# Altium schematic sheet HardwareSchematicv2.SchDoc
size A4; SheetNumber: 3; SheetTotal: 3
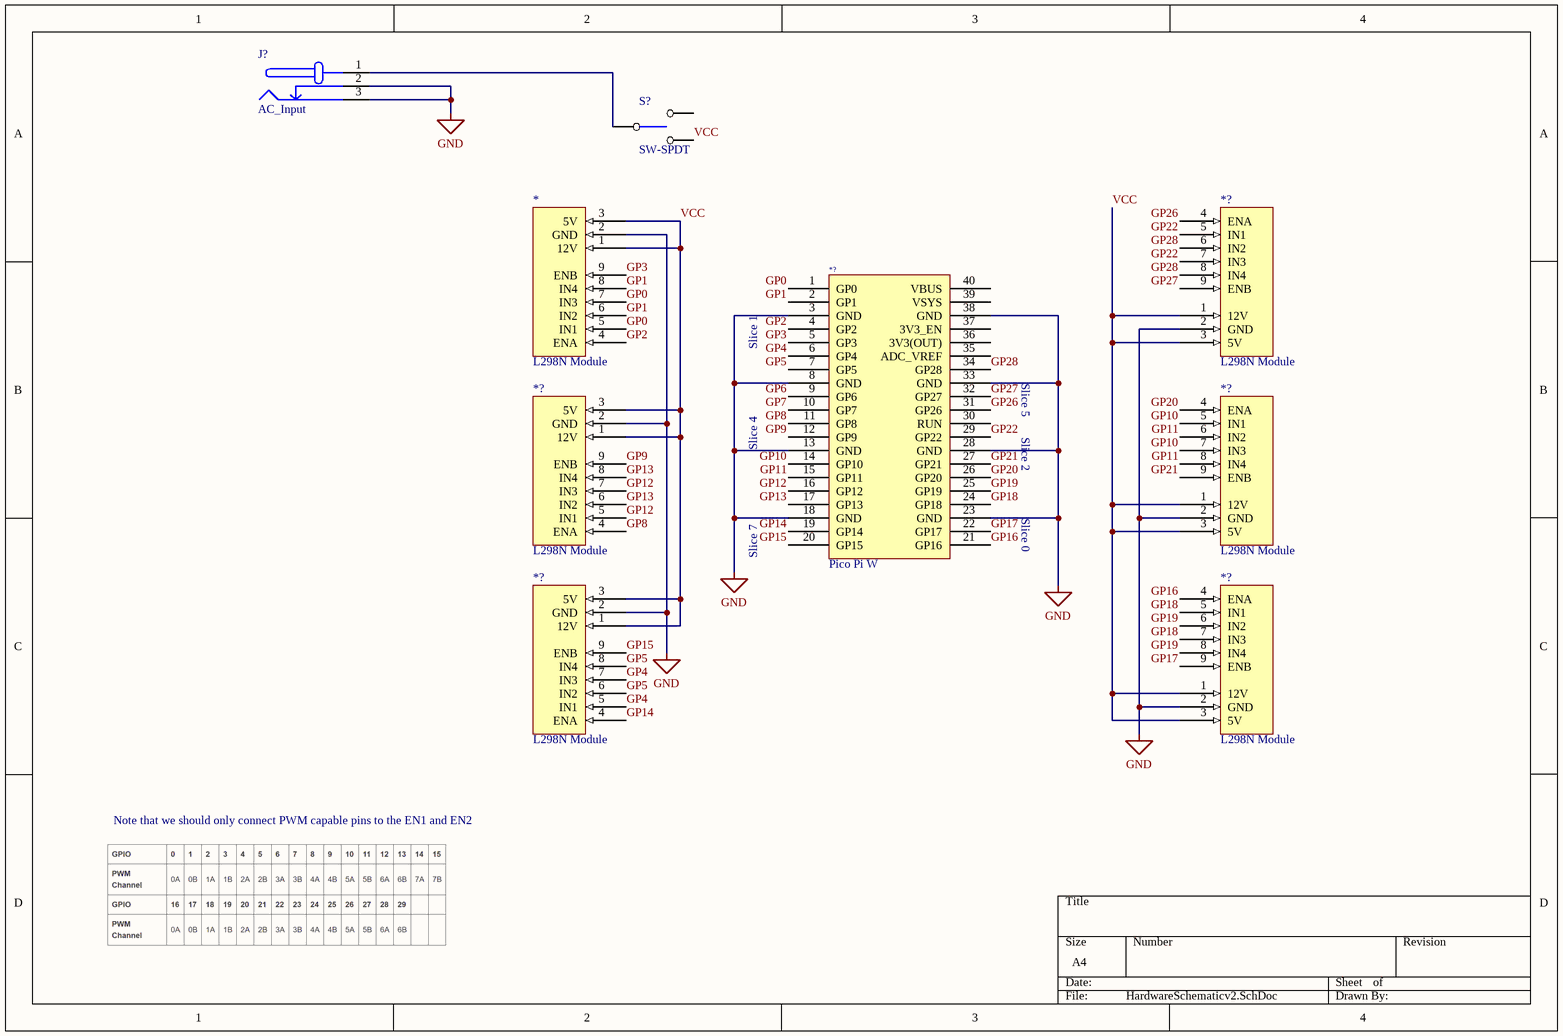
[diagram p0: HardwareSchematicv2.SchDoc]

## Parts
(Parts that share a designator on the sheet are numbered #1, #2 ... from top to bottom, then left to right.)
*  L298N Module  [New footprint 1]
*?#1  L298N Module  [New footprint 1]
*?#2  Pico Pi W  [New footprint 1]
*?#3  L298N Module  [New footprint 1]
*?#4  L298N Module  [New footprint 1]
*?#5  L298N Module  [New footprint 1]
*?#6  L298N Module  [New footprint 1]
J?  AC_Input  [AC-Socket]
S?  SW-SPDT  [SW-SPDT]

## Nets
GND: *.2(GND) *?#1.2(GND) *?#2.3(GND) *?#2.8(GND) *?#2.13(GND) *?#2.18(GND) *?#2.23(GND) *?#2.28(GND) *?#2.33(GND) *?#2.38(GND) *?#3.2(GND) *?#4.2(GND) *?#5.2(GND) *?#6.2(GND) J?.2(GND_ALT) J?.3(GND)
GP0: *.5(IN1) *.7(IN3) *?#2.1(GP0)
GP1: *.6(IN2) *.8(IN4) *?#2.2(GP1)
GP2: *.4(ENA) *?#2.4(GP2)
GP3: *.9(ENB) *?#2.5(GP3)
GP4: *?#2.6(GP4) *?#6.5(IN1) *?#6.7(IN3)
GP5: *?#2.7(GP5) *?#6.6(IN2) *?#6.8(IN4)
GP6: *?#2.9(GP6)
GP7: *?#2.10(GP7)
GP8: *?#2.11(GP8) *?#4.4(ENA)
GP9: *?#2.12(GP9) *?#4.9(ENB)
GP10: *?#2.14(GP10) *?#3.5(IN1) *?#3.7(IN3)
GP11: *?#2.15(GP11) *?#3.6(IN2) *?#3.8(IN4)
GP12: *?#2.16(GP12) *?#4.5(IN1) *?#4.7(IN3)
GP13: *?#2.17(GP13) *?#4.6(IN2) *?#4.8(IN4)
GP14: *?#2.19(GP14) *?#6.4(ENA)
GP15: *?#2.20(GP15) *?#6.9(ENB)
GP16: *?#2.21(GP16) *?#5.4(ENA)
GP17: *?#2.22(GP17) *?#5.9(ENB)
GP18: *?#2.24(GP18) *?#5.5(IN1) *?#5.7(IN3)
GP19: *?#2.25(GP19) *?#5.6(IN2) *?#5.8(IN4)
GP20: *?#2.26(GP20) *?#3.4(ENA)
GP21: *?#2.27(GP21) *?#3.9(ENB)
GP22: *?#1.5(IN1) *?#1.7(IN3) *?#2.29(GP22)
GP26: *?#1.4(ENA) *?#2.31(GP26)
GP27: *?#1.9(ENB) *?#2.32(GP27)
GP28: *?#1.6(IN2) *?#1.8(IN4) *?#2.34(GP28)
VCC: *.1(12V) *.3(5V) *?#1.1(12V) *?#1.3(5V) *?#3.1(12V) *?#3.3(5V) *?#4.1(12V) *?#4.3(5V) *?#5.1(12V) *?#5.3(5V) *?#6.1(12V) *?#6.3(5V) S?.3
NetJ?_1: J?.1(VCC) S?.2

Not connected (* = marked no-connect by the designer): *?#2 30(RUN) 35(ADC_VREF) 36(3V3(OUT)) 37(3V3_EN) 39(VSYS) 40(VBUS); S? 1

## Notes on the sheet
- Slice 1
- Slice 5
- Slice 4
- Slice 2
- Slice 0
- Slice 7
- Note that we should only connect PWM capable pins to the EN1 and EN2

## Library data of the parts
* *?#1 *?#3-*?#6 = L298N_Board-1: Direct conector for H-Bridge
*?#2 = Pico-Pi-W-1: micro
J? = CMP-007-000005-1: DC barrel jack connection to AC source; Value: socket; Component Type: Standard; Design Item ID: AC_Input; Source: EE209_SchLib.SchLib; Pin Count: 3
S? = CMP-025-000001-1: Toggle Switch; Source: COMSYS301.SCHLIB; Pin Count: 3; Component Type: Standard; Design Item ID: SW-SPDT